# Altium schematic sheet esp8266xds.SchDoc
size A4; SheetNumber: 1; SheetTotal: 1
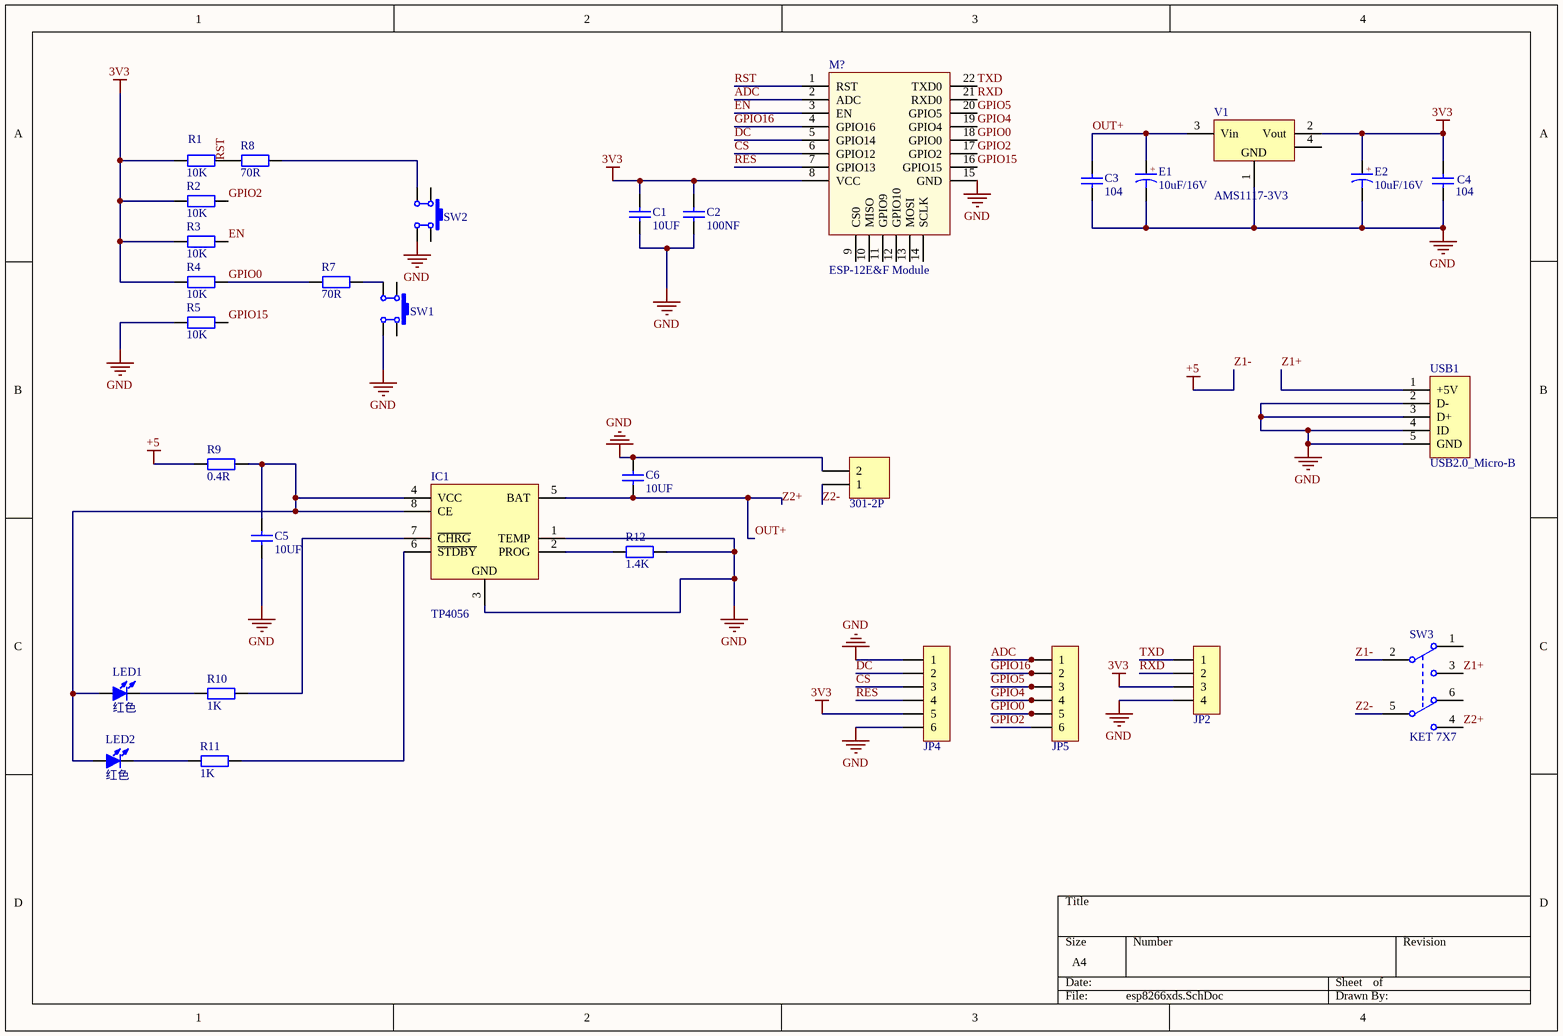
[diagram p0: esp8266xds.SchDoc]

## Parts
C1  10UF  [C0805_L]
C2  100NF  [C0805_L]
C3  104  [C0805_L]
C4  104  [C0805_L]
C5  10UF  [C0805_L]
C6  10UF  [C0805_L]
E1  10uF/16V  [C_3216]
E2  10uF/16V  [C_3216]
IC1  TP4056  [SOIC-8_EP]
JP2  HDR-1X4  [XH2.54-LI-4P]  (value not drawn)
JP4  HDR-1X6  [XH2.54-LI-6P]  (value not drawn)
JP5  HDR-1X6  [XH2.54-LI-6P]  (value not drawn)
KF?  301-2P
LED1  红色  [LED0805_G]
LED2  红色  [LED0805_G]
M?  ESP-12E&F Module  [ESP-12E&F Module]
R1  10K  [R0805_L]
R2  10K  [R0805_L]
R3  10K  [R0805_L]
R4  10K  [R0805_L]
R5  10K  [R0805_L]
R7  70R  [R0805_L]
R8  70R  [R0805_L]
R9  0.4R  [R0805_L]
R10  1K  [R0805_L]
R11  1K  [R0805_L]
R12  1.4K  [R0805_L]
SW1  4x4x1.5  [SW SMD-4*4*1.5]  (value not drawn)
SW2  4x4x1.5  [SW SMD-4*4*1.5]  (value not drawn)
SW3  KET 7X7  [KFT DIP-7X7]
USB1  USB2.0_Micro-B  [USB2.0_MICRO-B_1]
V1  AMS1117-3V3  [SOT223_L]

## Nets
3V3: C1.1 C2.1 C4.2 E2.1(A) JP2.3 JP4.5 M?.8(VCC) R1.1 R2.1 R3.1 R4.1 V1.2(Vout)
GND: C1.2 C2.2 C3.1 C4.1 C5.1 C6.2 E1.2(K) E2.2(K) IC1.1(TEMP) IC1.3(GND) JP2.4 JP4.1 JP4.6 KF?.2 M?.15(GND) R5.1 R12.2 SW1.3 SW2.3 USB1.2(D-) USB1.3(D+) USB1.4(ID) USB1.5(GND) V1.1(GND)
Z1-: R9.1 SW3.2(COM2)  [also labelled +5]
ADC: JP5.1 M?.2(ADC)
CS: JP4.3 M?.6(GPIO12)
DC: JP4.2 M?.5(GPIO14)
EN: M?.3(EN) R3.2
GPIO0: JP5.5 M?.18(GPIO0) R4.2 R7.1
GPIO2: JP5.6 M?.17(GPIO2) R2.2
GPIO4: JP5.4 M?.19(GPIO4)
GPIO5: JP5.3 M?.20(GPIO5)
GPIO15: M?.16(GPIO15) R5.2
GPIO16: JP5.2 M?.4(GPIO16)
OUT+: C3.2 C6.1 E1.1(A) IC1.5(BAT) SW3.4(NO2) V1.3(Vin)  [also labelled Z2+]
RES: JP4.4 M?.7(GPIO13)
RST: M?.1(RST) R1.2 R8.1
RXD: JP2.2 M?.21(RXD0)
TXD: JP2.1 M?.22(TXD0)
Z1+: SW3.3(NO1) USB1.1(+5V)
Z2-: KF?.1 SW3.5(COM2)
NetC5_2: C5.2 IC1.4(VCC) IC1.8(CE) LED1.1(A) LED2.1(A) R9.2
NetIC1_2: IC1.2(PROG) R12.1
NetIC1_6: IC1.6(~{STDBY}) R11.2
NetIC1_7: IC1.7(~{CHRG}) R10.2
NetLED1_2: LED1.2(K) R10.1
NetLED2_2: LED2.2(K) R11.1
NetR7_2: R7.2 SW1.4
NetR8_2: R8.2 SW2.4

Not connected (* = marked no-connect by the designer): M? 9(CS0) 10(MISO) 11(GPIO9) 12(GPIO10) 13(MOSI) 14(SCLK); SW1 1 2; SW2 1 2; SW3 1(NC1) 6(NC2); V1 4(GND)

## Notes on the sheet
- (in symbol CT) +

## Library data of the parts
C1-C6 = C: 贴片电容/MLCC电容; BOM名称: 无极性贴片电容; 联系卖家，免费查找封装: 唯一出售店铺网址https://shop463601444.taobao.com
E1 E2 = CT: 贴片钽电容; 联系卖家，免费查找封装: 唯一出售店铺网址https://shop463601444.taobao.com; BOM名称: 贴片钽电容
IC1 = TP4056: 锂电池充电管理; 封装库来自淘宝卖家ID：黄晶宝石: 其他店铺购入的买家，请立即申请退款，本店现金奖励20~1000元; BOM名称: 锂电池充电管理
JP2 = Header 4: 4P接插件; 联系卖家，免费查找封装: 唯一出售店铺网址https://shop463601444.taobao.com; 封装库来自淘宝卖家ID:黄晶宝石: 其他店铺购入均为盗版假冒封装库，请立即申请退款，本店现金奖励20~200元; BOM名称: 4P接插件
JP4 JP5 = Header 6: 6P接插件; 联系卖家，免费查找封装: 唯一出售店铺网址https://shop463601444.taobao.com; 封装库来自淘宝卖家ID:黄晶宝石: 其他店铺购入均为盗版假冒封装库，请立即申请退款，本店现金奖励20~200元; BOM名称: 6P接插件
KF? = KF301-2P: 接线端子
LED1 LED2 = LED-SMD: 贴片LED; 封装库来自淘宝卖家ID：黄晶宝石: 其他店铺购入均为盗版封装库，请立即申请退款，本店现金奖励20~200元; BOM名称: 贴片LED
R1-R5 R7-R12 = R: 贴片电阻; 联系卖家，免费查找封装: 唯一出售店铺网址https://shop463601444.taobao.com; BOM名称: 贴片电阻
SW1 SW2 = SW SMD-4x4: 贴片4x4轻触开关; 联系卖家，免费查找封装: 唯一出售店铺网址https://shop463601444.taobao.com; 封装库来自淘宝卖家ID：黄晶宝石: 其他店铺购入的，请立即申请退款，本店现金奖励20~500元; BOM名称: 贴片4x4轻触开关
SW3 = KET 7X7: 7*7自锁开关; 联系卖家，免费查找封装: 唯一出售店铺网址https://shop463601444.taobao.com; 封装库来自淘宝卖家ID：黄晶宝石: 其他店铺购入的，请立即申请退款，本店现金奖励20~500元; BOM名称: 7*7自锁开关
USB1 = USB2.0_Micro-B: USB2.0_Micro-B母座; 联系卖家 免费技术支持: 封装库来自淘宝卖家ID：黄晶宝石; BOM名称: USB2.0_Micro-B母座
V1 = AMS1117: 三端稳压芯片; BOM名称: 稳压芯片; 封装库来自淘宝卖家ID：黄晶宝石: 其他店铺购入的买家，请立即申请退款，本店现金奖励20~1000元